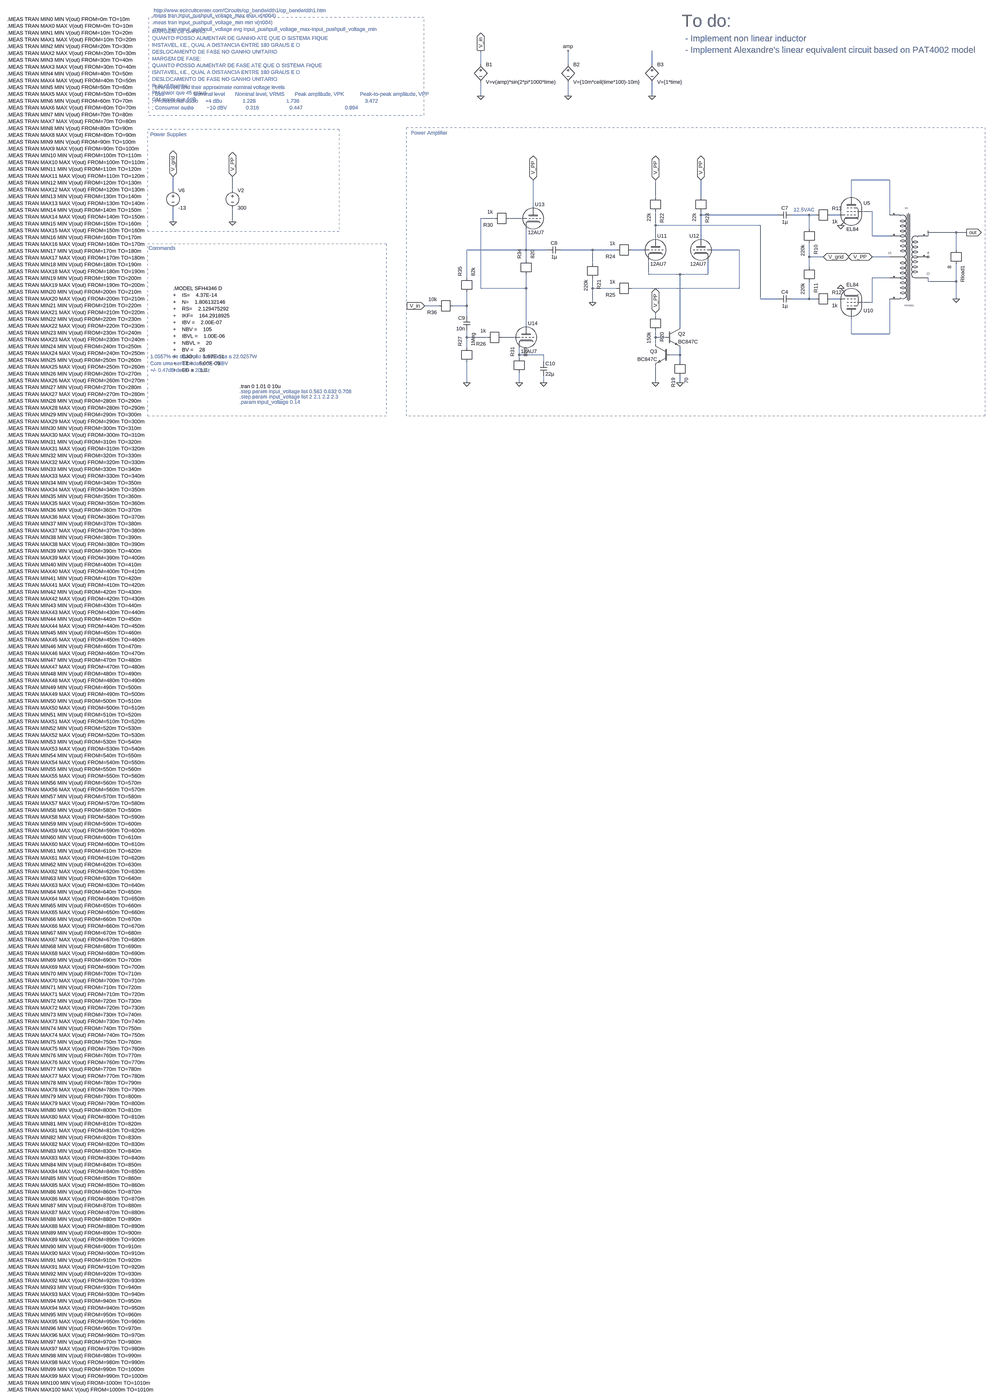
[diagram p0: schematic POWER_AMP_IC_rework_el84_transient_stairs.asc, whole sheet]
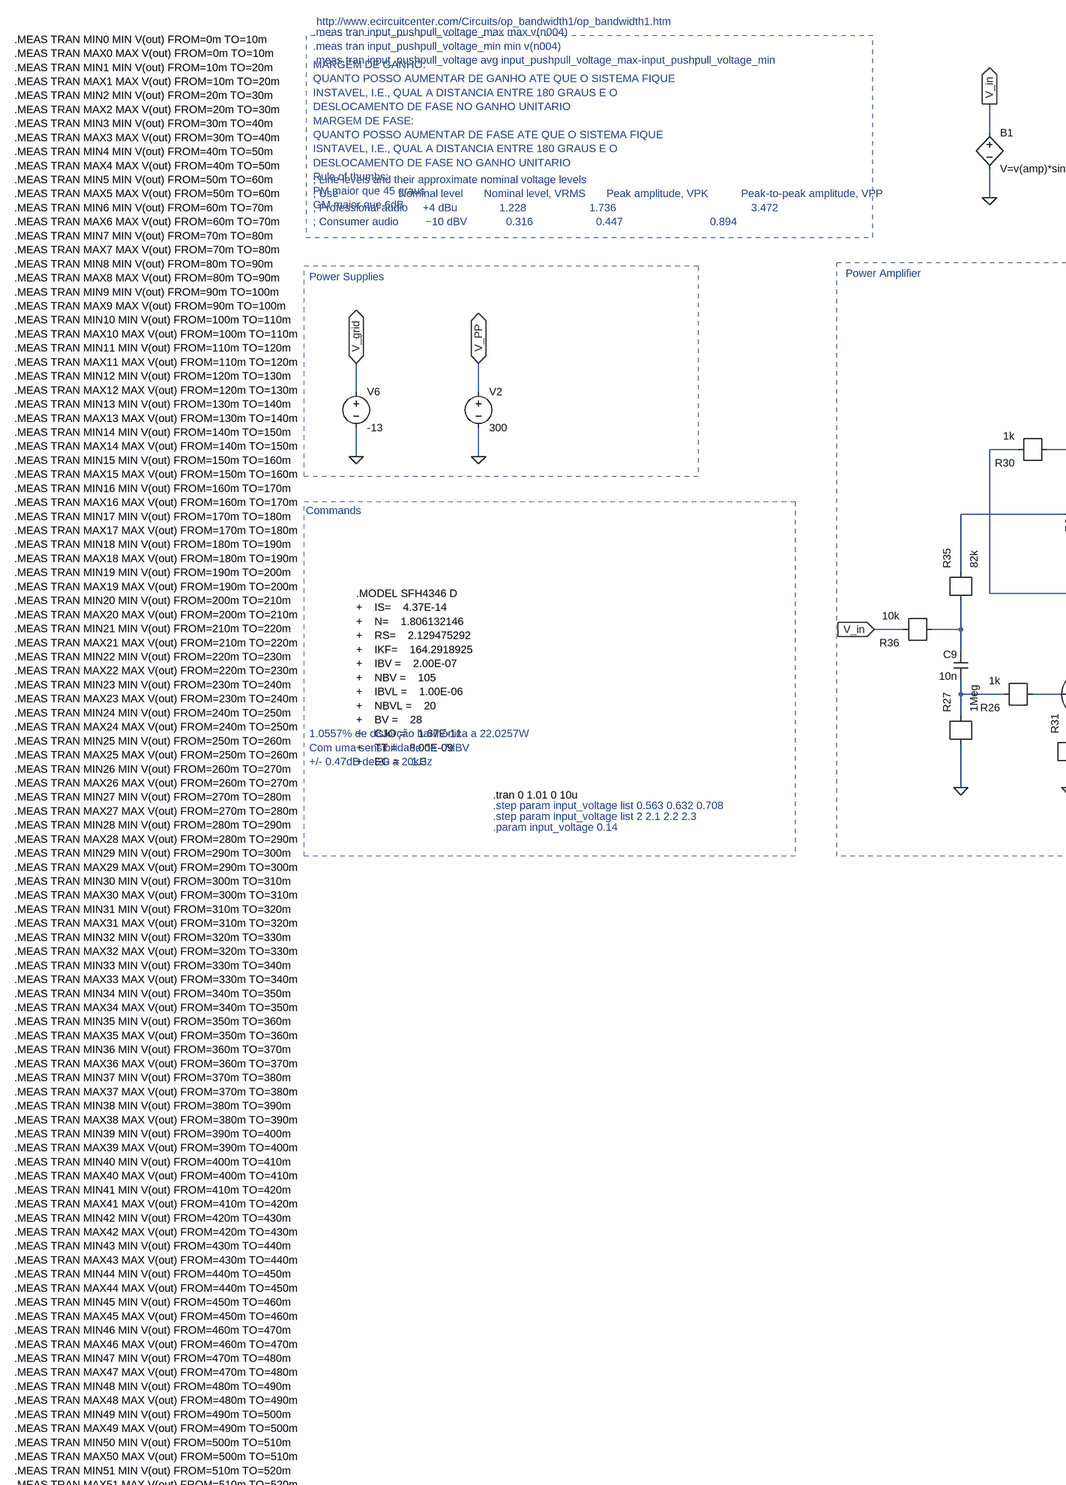
[diagram p1: schematic POWER_AMP_IC_rework_el84_transient_stairs.asc, part, row 1 of 2, column 1 of 2]
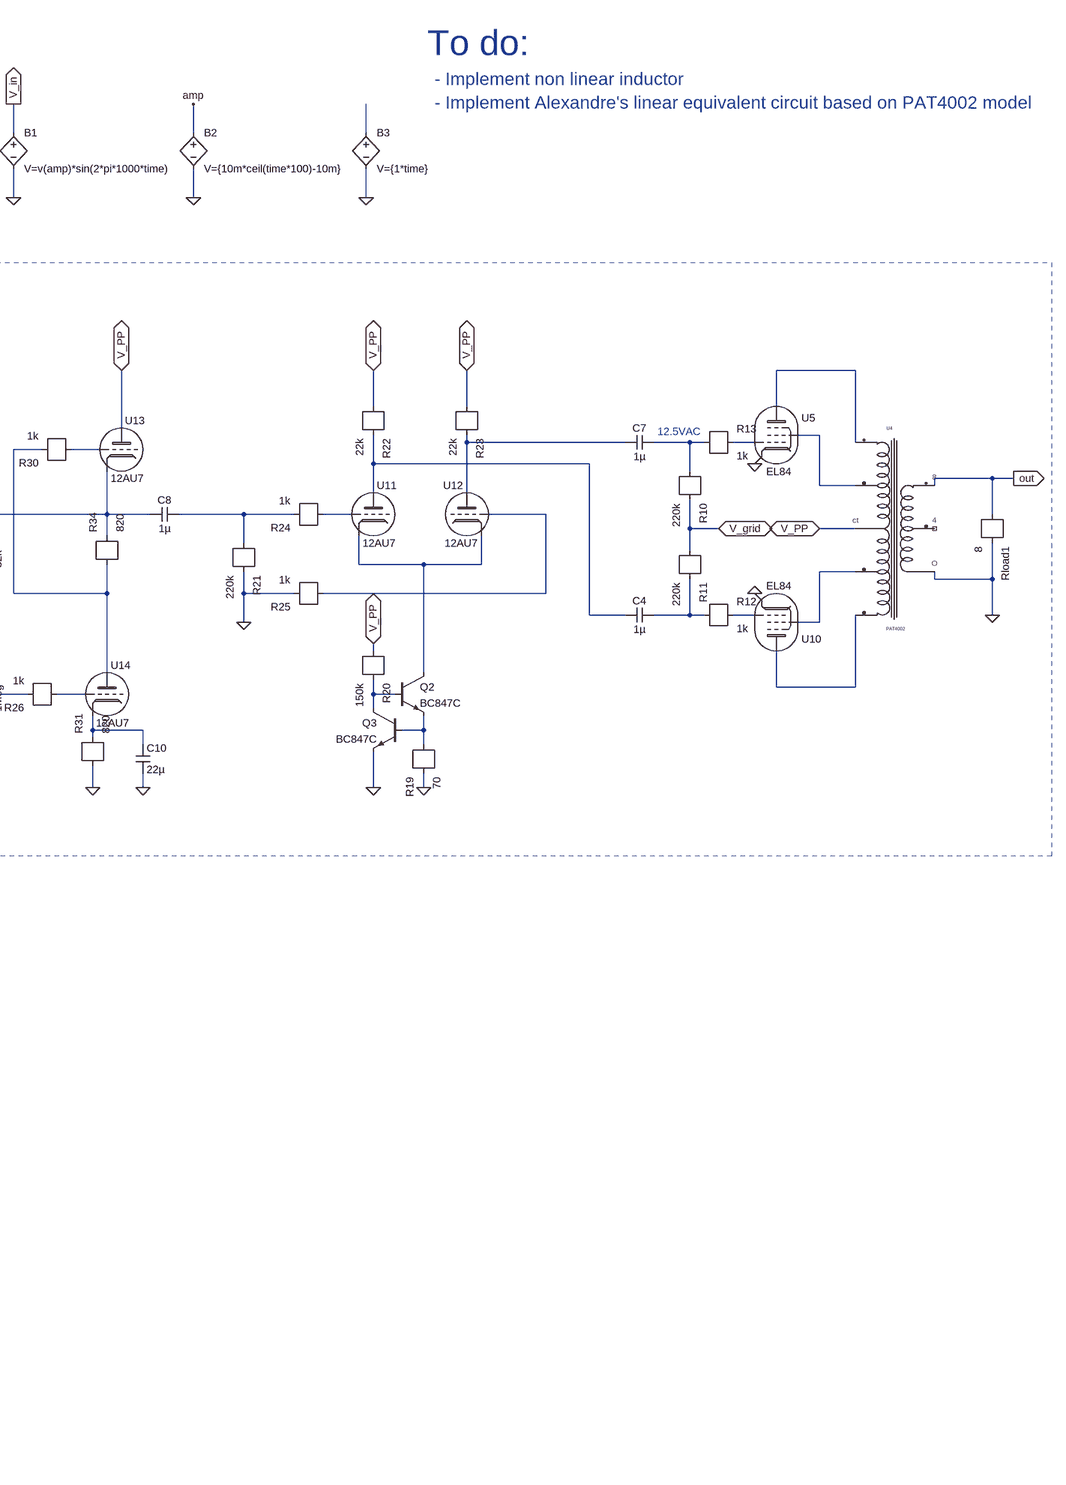
[diagram p2: schematic POWER_AMP_IC_rework_el84_transient_stairs.asc, part, row 1 of 2, column 2 of 2]
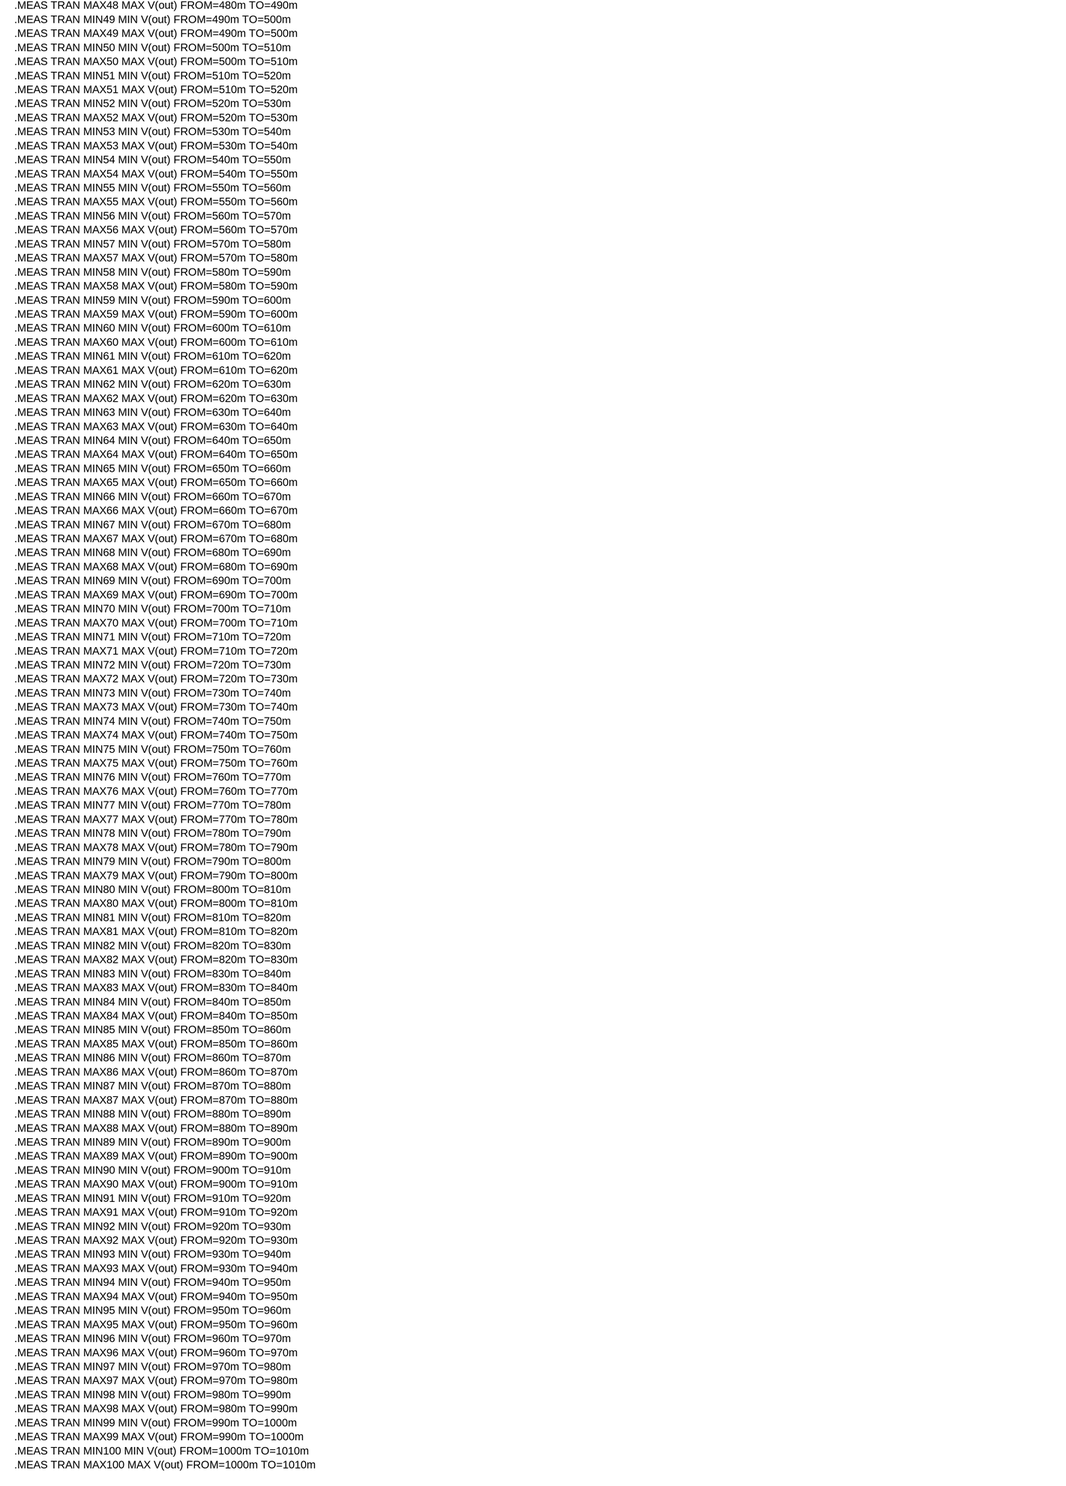
[diagram p3: schematic POWER_AMP_IC_rework_el84_transient_stairs.asc, part, row 2 of 2, column 1 of 2]
POWER_AMP_IC_rework_el84_transient_stairs.asc, the LTspice schematic file:
Version 4
SHEET 1 2188 56588
WIRE -1584 752 -1584 688
WIRE -1184 752 -1184 688
WIRE -800 752 -800 688
WIRE -1584 896 -1584 832
WIRE -1184 896 -1184 832
WIRE -800 896 -800 832
WIRE 288 1280 112 1280
WIRE -2992 1328 -2992 1264
WIRE -2720 1328 -2720 1264
WIRE -784 1360 -784 1280
WIRE -576 1360 -576 1280
WIRE 112 1360 112 1280
WIRE -1344 1408 -1344 1280
WIRE 208 1424 160 1424
WIRE -576 1440 -576 1424
WIRE -224 1440 -576 1440
WIRE -80 1440 -160 1440
WIRE -48 1440 -80 1440
WIRE 64 1440 16 1440
WIRE 288 1440 288 1280
WIRE -1520 1456 -1584 1456
WIRE -1392 1456 -1456 1456
WIRE -2992 1472 -2992 1408
WIRE -2720 1472 -2720 1408
WIRE -784 1488 -784 1424
WIRE -304 1488 -784 1488
WIRE -80 1504 -80 1440
WIRE 592 1520 464 1520
WIRE 640 1520 592 1520
WIRE 208 1536 208 1424
WIRE 288 1536 208 1536
WIRE 464 1536 464 1520
WIRE -784 1552 -784 1488
WIRE -576 1552 -576 1440
WIRE -1376 1600 -1376 1504
WIRE -1376 1600 -1648 1600
WIRE -1280 1600 -1376 1600
WIRE -1072 1600 -1216 1600
WIRE -960 1600 -1072 1600
WIRE -832 1600 -896 1600
WIRE -400 1600 -528 1600
WIRE 592 1600 592 1520
WIRE -80 1632 -80 1568
WIRE -16 1632 -80 1632
WIRE 288 1632 208 1632
WIRE -1376 1648 -1376 1600
WIRE -1072 1664 -1072 1600
WIRE -80 1680 -80 1632
WIRE -816 1712 -816 1648
WIRE -672 1712 -816 1712
WIRE -544 1712 -544 1648
WIRE -544 1712 -672 1712
WIRE -1648 1728 -1648 1600
WIRE 288 1728 208 1728
WIRE 464 1744 464 1728
WIRE 592 1744 592 1664
WIRE 592 1744 464 1744
WIRE -1584 1776 -1584 1456
WIRE -1376 1776 -1376 1712
WIRE -1376 1776 -1584 1776
WIRE -1072 1776 -1072 1728
WIRE -960 1776 -1072 1776
WIRE -400 1776 -400 1600
WIRE -400 1776 -896 1776
WIRE -304 1824 -304 1488
WIRE -224 1824 -304 1824
WIRE -80 1824 -80 1744
WIRE -80 1824 -160 1824
WIRE -48 1824 -80 1824
WIRE 64 1824 16 1824
WIRE 592 1824 592 1744
WIRE -1072 1840 -1072 1776
WIRE 208 1840 208 1728
WIRE 208 1840 160 1840
WIRE -1776 1856 -1840 1856
WIRE -1648 1856 -1648 1792
WIRE -1648 1856 -1712 1856
WIRE -1648 1904 -1648 1856
WIRE -784 1904 -784 1888
WIRE -1376 1952 -1376 1776
WIRE -672 1952 -672 1712
WIRE 112 1984 112 1904
WIRE 288 1984 288 1824
WIRE 288 1984 112 1984
WIRE -1648 2000 -1648 1968
WIRE -1552 2000 -1648 2000
WIRE -1424 2000 -1488 2000
WIRE -784 2000 -784 1968
WIRE -736 2000 -784 2000
WIRE -784 2032 -784 2000
WIRE -1648 2048 -1648 2000
WIRE -1408 2080 -1408 2048
WIRE -1296 2080 -1408 2080
WIRE -672 2080 -672 2048
WIRE -672 2080 -720 2080
WIRE -1408 2096 -1408 2080
WIRE -1296 2112 -1296 2080
WIRE -672 2112 -672 2080
WIRE -1648 2208 -1648 2112
WIRE -1408 2208 -1408 2160
WIRE -1296 2208 -1296 2176
WIRE -784 2208 -784 2128
WIRE -672 2208 -672 2176
FLAG -2720 1472 0
FLAG -2992 1472 0
FLAG -2992 1264 V_grid
IOPIN -2992 1264 BiDir
FLAG 64 1488 0
FLAG 64 1776 0
FLAG -16 1632 V_grid
IOPIN -16 1632 BiDir
FLAG 592 1824 0
FLAG 640 1520 out
IOPIN 640 1520 Out
FLAG -2720 1264 V_PP
IOPIN -2720 1264 BiDir
FLAG 208 1632 V_PP
IOPIN 208 1632 BiDir
FLAG -1072 1840 0
FLAG -1840 1856 V_in
IOPIN -1840 1856 In
FLAG -1648 2208 0
FLAG -1408 2208 0
FLAG -672 2208 0
FLAG -784 2208 0
FLAG -784 1888 V_PP
IOPIN -784 1888 BiDir
FLAG -576 1280 V_PP
IOPIN -576 1280 BiDir
FLAG -784 1280 V_PP
IOPIN -784 1280 BiDir
FLAG -1344 1280 V_PP
IOPIN -1344 1280 BiDir
FLAG -1296 2208 0
FLAG -1584 896 0
FLAG -1184 896 0
FLAG -1584 688 V_in
IOPIN -1584 688 Out
FLAG -800 896 0
FLAG -1184 688 amp
SYMBOL voltage -2720 1312 R0
SYMATTR InstName V2
SYMATTR Value 300
SYMBOL voltage -2992 1312 R0
SYMATTR InstName V6
SYMATTR Value -13
SYMBOL r -80 1504 R90
SYMATTR InstName R10
SYMATTR Value 220k
SYMBOL r -80 1680 R90
SYMATTR InstName R11
SYMATTR Value 220k
SYMBOL r -48 1824 R0
SYMATTR InstName R12
SYMATTR Value 1k
SYMBOL r -48 1440 R0
SYMATTR InstName R13
SYMATTR Value 1k
SYMBOL cap -160 1808 R90
WINDOW 0 0 32 VBottom 2
WINDOW 3 32 32 VTop 2
SYMATTR InstName C4
SYMATTR Value 1µ
SYMBOL cap -160 1424 R90
WINDOW 0 0 32 VBottom 2
WINDOW 3 32 32 VTop 2
SYMATTR InstName C7
SYMATTR Value 1µ
SYMBOL r 592 1600 R90
SYMATTR InstName Rload1
SYMATTR Value 8
SYMBOL PAT4002 368 1632 R0
SYMATTR InstName U4
SYMBOL EL84 112 1424 R0
SYMATTR InstName U5
SYMBOL EL84 112 1840 M180
SYMATTR InstName U10
SYMBOL npn -736 1952 R0
SYMATTR InstName Q2
SYMATTR Value BC847C
SYMBOL npn -720 2032 M0
SYMATTR InstName Q3
SYMATTR Value BC847C
SYMBOL r -672 2112 M90
SYMATTR InstName R19
SYMATTR Value 70
SYMBOL r -784 1904 R90
SYMATTR InstName R20
SYMATTR Value 150k
SYMBOL r -1072 1664 R90
SYMATTR InstName R21
SYMATTR Value 220k
SYMBOL r -784 1360 R90
SYMATTR InstName R22
SYMATTR Value 22k
SYMBOL r -576 1360 R90
SYMATTR InstName R23
SYMATTR Value 22k
SYMBOL 12AU7 -784 1600 R0
SYMATTR InstName U11
SYMBOL 12AU7 -576 1600 M0
SYMATTR InstName U12
SYMBOL cap -1216 1584 R90
WINDOW 0 0 32 VBottom 2
WINDOW 3 32 32 VTop 2
SYMATTR InstName C8
SYMATTR Value 1µ
SYMBOL r -896 1600 R180
SYMATTR InstName R24
SYMATTR Value 1k
SYMBOL r -896 1776 R180
SYMATTR InstName R25
SYMATTR Value 1k
SYMBOL r -1488 2000 R180
SYMATTR InstName R26
SYMATTR Value 1k
SYMBOL r -1648 2112 R270
SYMATTR InstName R27
SYMATTR Value 1Meg
SYMBOL r -1456 1456 R180
SYMATTR InstName R30
SYMATTR Value 1k
SYMBOL r -1408 2160 R270
SYMATTR InstName R31
SYMATTR Value 820
SYMBOL r -1376 1712 R270
SYMATTR InstName R34
SYMATTR Value 820
SYMBOL 12AU7 -1344 1456 R0
SYMATTR InstName U13
SYMBOL 12AU7 -1376 2000 R0
SYMATTR InstName U14
SYMBOL r -1648 1792 R270
SYMATTR InstName R35
SYMATTR Value 82k
SYMBOL cap -1632 1904 M0
SYMATTR InstName C9
SYMATTR Value 10n
SYMBOL r -1712 1856 R180
SYMATTR InstName R36
SYMATTR Value 10k
SYMBOL cap -1312 2112 R0
SYMATTR InstName C10
SYMATTR Value 22µ
SYMBOL bv -1584 736 R0
SYMATTR InstName B1
SYMATTR Value V=v(amp)*sin(2*pi*1000*time)
SYMBOL bv -1184 736 R0
SYMATTR InstName B2
SYMATTR Value V={10m*ceil(time*100)-10m}
SYMBOL bv -800 736 R0
SYMATTR InstName B3
SYMATTR Value V={1*time}
TEXT -2688 2224 Left 2 !.tran 0 1.01 0 10u
TEXT -2992 1776 Left 2 !.MODEL SFH4346 D	\n+	IS=	4.37E-14\n+	N=	1.806132146\n+	RS=	2.129475292\n+	IKF=	164.2918925\n+	IBV =	2.00E-07\n+	NBV =	105\n+	IBVL =	1.00E-06\n+	NBVL =	20\n+	BV =	28\n+	CJO =	1.67E-11\n+	TT =	8.00E-09\n+	EG =	1.3
TEXT -3104 1592 Left 2 ;Commands
TEXT -3096 1072 Left 2 ;Power Supplies
TEXT -3088 600 Left 2 ;MARGEM DE GANHO:\nQUANTO POSSO AUMENTAR DE GANHO ATE QUE O SISTEMA FIQUE\nINSTAVEL, I.E., QUAL A DISTANCIA ENTRE 180 GRAUS E O \nDESLOCAMENTO DE FASE NO GANHO UNITARIO\nMARGEM DE FASE:\nQUANTO POSSO AUMENTAR DE FASE ATE QUE O SISTEMA FIQUE \nISNTAVEL, I.E., QUAL A DISTANCIA ENTRE 180 GRAUS E O \nDESLOCAMENTO DE FASE NO GANHO UNITARIO\nRule of thumbs:\nPM maior que 45 graus\nGM maior que 6dB
TEXT -1904 1064 Left 2 ;Power Amplifier
TEXT -2688 2248 Left 2 ;.step param input_voltage list 0.563 0.632 0.708
TEXT -3096 2088 Left 2 ;1.0557% de distorção harmônica a 22.0257W\nCom uma sensibilidade de -7dBV\n+/- 0.47dB de 20 a 20kHz
TEXT -2688 2272 Left 2 ;.step param input_voltage list 2 2.1 2.2 2.3
TEXT -2688 2296 Left 2 ;.param input_voltage 0.14
TEXT -3088 856 Left 2 ;; Line levels and their approximate nominal voltage levels\n; Use                	Nominal level   	Nominal level, VRMS   	Peak amplitude, VPK   		Peak-to-peak amplitude, VPP\n; Professional audio 	+4 dBu          	1.228                 	1.736                 							3.472\n; Consumer audio     	−10 dBV         	0.316                 	0.447                 			0.894
TEXT -3088 528 Left 2 ;.meas tran input_pushpull_voltage_max max v(n004)\n.meas tran input_pushpull_voltage_min min v(n004)\n.meas tran input_pushpull_voltage avg input_pushpull_voltage_max-input_pushpull_voltage_min
TEXT -152 1416 Left 2 ;12.5VAC
TEXT -3080 504 Left 2 ;http://www.ecircuitcenter.com/Circuits/op_bandwidth1/op_bandwidth1.htm
TEXT -664 552 Left 6 ;To do:
TEXT -648 632 Left 4 ;- Implement non linear inductor\n- Implement Alexandre's linear equivalent circuit based on PAT4002 model
TEXT -3752 544 Left 2 !.MEAS TRAN MIN0 MIN V(out) FROM=0m TO=10m\n.MEAS TRAN MAX0 MAX V(out) FROM=0m TO=10m\n.MEAS TRAN MIN1 MIN V(out) FROM=10m TO=20m\n.MEAS TRAN MAX1 MAX V(out) FROM=10m TO=20m\n.MEAS TRAN MIN2 MIN V(out) FROM=20m TO=30m\n.MEAS TRAN MAX2 MAX V(out) FROM=20m TO=30m\n.MEAS TRAN MIN3 MIN V(out) FROM=30m TO=40m\n.MEAS TRAN MAX3 MAX V(out) FROM=30m TO=40m\n.MEAS TRAN MIN4 MIN V(out) FROM=40m TO=50m\n.MEAS TRAN MAX4 MAX V(out) FROM=40m TO=50m\n.MEAS TRAN MIN5 MIN V(out) FROM=50m TO=60m\n.MEAS TRAN MAX5 MAX V(out) FROM=50m TO=60m\n.MEAS TRAN MIN6 MIN V(out) FROM=60m TO=70m\n.MEAS TRAN MAX6 MAX V(out) FROM=60m TO=70m\n.MEAS TRAN MIN7 MIN V(out) FROM=70m TO=80m\n.MEAS TRAN MAX7 MAX V(out) FROM=70m TO=80m\n.MEAS TRAN MIN8 MIN V(out) FROM=80m TO=90m\n.MEAS TRAN MAX8 MAX V(out) FROM=80m TO=90m\n.MEAS TRAN MIN9 MIN V(out) FROM=90m TO=100m\n.MEAS TRAN MAX9 MAX V(out) FROM=90m TO=100m\n.MEAS TRAN MIN10 MIN V(out) FROM=100m TO=110m\n.MEAS TRAN MAX10 MAX V(out) FROM=100m TO=110m\n.MEAS TRAN MIN11 MIN V(out) FROM=110m TO=120m\n.MEAS TRAN MAX11 MAX V(out) FROM=110m TO=120m\n.MEAS TRAN MIN12 MIN V(out) FROM=120m TO=130m\n.MEAS TRAN MAX12 MAX V(out) FROM=120m TO=130m\n.MEAS TRAN MIN13 MIN V(out) FROM=130m TO=140m\n.MEAS TRAN MAX13 MAX V(out) FROM=130m TO=140m\n.MEAS TRAN MIN14 MIN V(out) FROM=140m TO=150m\n.MEAS TRAN MAX14 MAX V(out) FROM=140m TO=150m\n.MEAS TRAN MIN15 MIN V(out) FROM=150m TO=160m\n.MEAS TRAN MAX15 MAX V(out) FROM=150m TO=160m\n.MEAS TRAN MIN16 MIN V(out) FROM=160m TO=170m\n.MEAS TRAN MAX16 MAX V(out) FROM=160m TO=170m\n.MEAS TRAN MIN17 MIN V(out) FROM=170m TO=180m\n.MEAS TRAN MAX17 MAX V(out) FROM=170m TO=180m\n.MEAS TRAN MIN18 MIN V(out) FROM=180m TO=190m\n.MEAS TRAN MAX18 MAX V(out) FROM=180m TO=190m\n.MEAS TRAN MIN19 MIN V(out) FROM=190m TO=200m\n.MEAS TRAN MAX19 MAX V(out) FROM=190m TO=200m\n.MEAS TRAN MIN20 MIN V(out) FROM=200m TO=210m\n.MEAS TRAN MAX20 MAX V(out) FROM=200m TO=210m\n.MEAS TRAN MIN21 MIN V(out) FROM=210m TO=220m\n.MEAS TRAN MAX21 MAX V(out) FROM=210m TO=220m\n.MEAS TRAN MIN22 MIN V(out) FROM=220m TO=230m\n.MEAS TRAN MAX22 MAX V(out) FROM=220m TO=230m\n.MEAS TRAN MIN23 MIN V(out) FROM=230m TO=240m\n.MEAS TRAN MAX23 MAX V(out) FROM=230m TO=240m\n.MEAS TRAN MIN24 MIN V(out) FROM=240m TO=250m\n.MEAS TRAN MAX24 MAX V(out) FROM=240m TO=250m\n.MEAS TRAN MIN25 MIN V(out) FROM=250m TO=260m\n.MEAS TRAN MAX25 MAX V(out) FROM=250m TO=260m\n.MEAS TRAN MIN26 MIN V(out) FROM=260m TO=270m\n.MEAS TRAN MAX26 MAX V(out) FROM=260m TO=270m\n.MEAS TRAN MIN27 MIN V(out) FROM=270m TO=280m\n.MEAS TRAN MAX27 MAX V(out) FROM=270m TO=280m\n.MEAS TRAN MIN28 MIN V(out) FROM=280m TO=290m\n.MEAS TRAN MAX28 MAX V(out) FROM=280m TO=290m\n.MEAS TRAN MIN29 MIN V(out) FROM=290m TO=300m\n.MEAS TRAN MAX29 MAX V(out) FROM=290m TO=300m\n.MEAS TRAN MIN30 MIN V(out) FROM=300m TO=310m\n.MEAS TRAN MAX30 MAX V(out) FROM=300m TO=310m\n.MEAS TRAN MIN31 MIN V(out) FROM=310m TO=320m\n.MEAS TRAN MAX31 MAX V(out) FROM=310m TO=320m\n.MEAS TRAN MIN32 MIN V(out) FROM=320m TO=330m\n.MEAS TRAN MAX32 MAX V(out) FROM=320m TO=330m\n.MEAS TRAN MIN33 MIN V(out) FROM=330m TO=340m\n.MEAS TRAN MAX33 MAX V(out) FROM=330m TO=340m\n.MEAS TRAN MIN34 MIN V(out) FROM=340m TO=350m\n.MEAS TRAN MAX34 MAX V(out) FROM=340m TO=350m\n.MEAS TRAN MIN35 MIN V(out) FROM=350m TO=360m\n.MEAS TRAN MAX35 MAX V(out) FROM=350m TO=360m\n.MEAS TRAN MIN36 MIN V(out) FROM=360m TO=370m\n.MEAS TRAN MAX36 MAX V(out) FROM=360m TO=370m\n.MEAS TRAN MIN37 MIN V(out) FROM=370m TO=380m\n.MEAS TRAN MAX37 MAX V(out) FROM=370m TO=380m\n.MEAS TRAN MIN38 MIN V(out) FROM=380m TO=390m\n.MEAS TRAN MAX38 MAX V(out) FROM=380m TO=390m\n.MEAS TRAN MIN39 MIN V(out) FROM=390m TO=400m\n.MEAS TRAN MAX39 MAX V(out) FROM=390m TO=400m\n.MEAS TRAN MIN40 MIN V(out) FROM=400m TO=410m\n.MEAS TRAN MAX40 MAX V(out) FROM=400m TO=410m\n.MEAS TRAN MIN41 MIN V(out) FROM=410m TO=420m\n.MEAS TRAN MAX41 MAX V(out) FROM=410m TO=420m\n.MEAS TRAN MIN42 MIN V(out) FROM=420m TO=430m\n.MEAS TRAN MAX42 MAX V(out) FROM=420m TO=430m\n.MEAS TRAN MIN43 MIN V(out) FROM=430m TO=440m\n.MEAS TRAN MAX43 MAX V(out) FROM=430m TO=440m\n.MEAS TRAN MIN44 MIN V(out) FROM=440m TO=450m\n.MEAS TRAN MAX44 MAX V(out) FROM=440m TO=450m\n.MEAS TRAN MIN45 MIN V(out) FROM=450m TO=460m\n.MEAS TRAN MAX45 MAX V(out) FROM=450m TO=460m\n.MEAS TRAN MIN46 MIN V(out) FROM=460m TO=470m\n.MEAS TRAN MAX46 MAX V(out) FROM=460m TO=470m\n.MEAS TRAN MIN47 MIN V(out) FROM=470m TO=480m\n.MEAS TRAN MAX47 MAX V(out) FROM=470m TO=480m\n.MEAS TRAN MIN48 MIN V(out) FROM=480m TO=490m\n.MEAS TRAN MAX48 MAX V(out) FROM=480m TO=490m\n.MEAS TRAN MIN49 MIN V(out) FROM=490m TO=500m\n.MEAS TRAN MAX49 MAX V(out) FROM=490m TO=500m\n.MEAS TRAN MIN50 MIN V(out) FROM=500m TO=510m\n.MEAS TRAN MAX50 MAX V(out) FROM=500m TO=510m\n.MEAS TRAN MIN51 MIN V(out) FROM=510m TO=520m\n.MEAS TRAN MAX51 MAX V(out) FROM=510m TO=520m\n.MEAS TRAN MIN52 MIN V(out) FROM=520m TO=530m\n.MEAS TRAN MAX52 MAX V(out) FROM=520m TO=530m\n.MEAS TRAN MIN53 MIN V(out) FROM=530m TO=540m\n.MEAS TRAN MAX53 MAX V(out) FROM=530m TO=540m\n.MEAS TRAN MIN54 MIN V(out) FROM=540m TO=550m\n.MEAS TRAN MAX54 MAX V(out) FROM=540m TO=550m\n.MEAS TRAN MIN55 MIN V(out) FROM=550m TO=560m\n.MEAS TRAN MAX55 MAX V(out) FROM=550m TO=560m\n.MEAS TRAN MIN56 MIN V(out) FROM=560m TO=570m\n.MEAS TRAN MAX56 MAX V(out) FROM=560m TO=570m\n.MEAS TRAN MIN57 MIN V(out) FROM=570m TO=580m\n.MEAS TRAN MAX57 MAX V(out) FROM=570m TO=580m\n.MEAS TRAN MIN58 MIN V(out) FROM=580m TO=590m\n.MEAS TRAN MAX58 MAX V(out) FROM=580m TO=590m\n.MEAS TRAN MIN59 MIN V(out) FROM=590m TO=600m\n.MEAS TRAN MAX59 MAX V(out) FROM=590m TO=600m\n.MEAS TRAN MIN60 MIN V(out) FROM=600m TO=610m\n.MEAS TRAN MAX60 MAX V(out) FROM=600m TO=610m\n.MEAS TRAN MIN61 MIN V(out) FROM=610m TO=620m\n.MEAS TRAN MAX61 MAX V(out) FROM=610m TO=620m\n.MEAS TRAN MIN62 MIN V(out) FROM=620m TO=630m\n.MEAS TRAN MAX62 MAX V(out) FROM=620m TO=630m\n.MEAS TRAN MIN63 MIN V(out) FROM=630m TO=640m\n.MEAS TRAN MAX63 MAX V(out) FROM=630m TO=640m\n.MEAS TRAN MIN64 MIN V(out) FROM=640m TO=650m\n.MEAS TRAN MAX64 MAX V(out) FROM=640m TO=650m\n.MEAS TRAN MIN65 MIN V(out) FROM=650m TO=660m\n.MEAS TRAN MAX65 MAX V(out) FROM=650m TO=660m\n.MEAS TRAN MIN66 MIN V(out) FROM=660m TO=670m\n.MEAS TRAN MAX66 MAX V(out) FROM=660m TO=670m\n.MEAS TRAN MIN67 MIN V(out) FROM=670m TO=680m\n.MEAS TRAN MAX67 MAX V(out) FROM=670m TO=680m\n.MEAS TRAN MIN68 MIN V(out) FROM=680m TO=690m\n.MEAS TRAN MAX68 MAX V(out) FROM=680m TO=690m\n.MEAS TRAN MIN69 MIN V(out) FROM=690m TO=700m\n.MEAS TRAN MAX69 MAX V(out) FROM=690m TO=700m\n.MEAS TRAN MIN70 MIN V(out) FROM=700m TO=710m\n.MEAS TRAN MAX70 MAX V(out) FROM=700m TO=710m\n.MEAS TRAN MIN71 MIN V(out) FROM=710m TO=720m\n.MEAS TRAN MAX71 MAX V(out) FROM=710m TO=720m\n.MEAS TRAN MIN72 MIN V(out) FROM=720m TO=730m\n.MEAS TRAN MAX72 MAX V(out) FROM=720m TO=730m\n.MEAS TRAN MIN73 MIN V(out) FROM=730m TO=740m\n.MEAS TRAN MAX73 MAX V(out) FROM=730m TO=740m\n.MEAS TRAN MIN74 MIN V(out) FROM=740m TO=750m\n.MEAS TRAN MAX74 MAX V(out) FROM=740m TO=750m\n.MEAS TRAN MIN75 MIN V(out) FROM=750m TO=760m\n.MEAS TRAN MAX75 MAX V(out) FROM=750m TO=760m\n.MEAS TRAN MIN76 MIN V(out) FROM=760m TO=770m\n.MEAS TRAN MAX76 MAX V(out) FROM=760m TO=770m\n.MEAS TRAN MIN77 MIN V(out) FROM=770m TO=780m\n.MEAS TRAN MAX77 MAX V(out) FROM=770m TO=780m\n.MEAS TRAN MIN78 MIN V(out) FROM=780m TO=790m\n.MEAS TRAN MAX78 MAX V(out) FROM=780m TO=790m\n.MEAS TRAN MIN79 MIN V(out) FROM=790m TO=800m\n.MEAS TRAN MAX79 MAX V(out) FROM=790m TO=800m\n.MEAS TRAN MIN80 MIN V(out) FROM=800m TO=810m\n.MEAS TRAN MAX80 MAX V(out) FROM=800m TO=810m\n.MEAS TRAN MIN81 MIN V(out) FROM=810m TO=820m\n.MEAS TRAN MAX81 MAX V(out) FROM=810m TO=820m\n.MEAS TRAN MIN82 MIN V(out) FROM=820m TO=830m\n.MEAS TRAN MAX82 MAX V(out) FROM=820m TO=830m\n.MEAS TRAN MIN83 MIN V(out) FROM=830m TO=840m\n.MEAS TRAN MAX83 MAX V(out) FROM=830m TO=840m\n.MEAS TRAN MIN84 MIN V(out) FROM=840m TO=850m\n.MEAS TRAN MAX84 MAX V(out) FROM=840m TO=850m\n.MEAS TRAN MIN85 MIN V(out) FROM=850m TO=860m\n.MEAS TRAN MAX85 MAX V(out) FROM=850m TO=860m\n.MEAS TRAN MIN86 MIN V(out) FROM=860m TO=870m\n.MEAS TRAN MAX86 MAX V(out) FROM=860m TO=870m\n.MEAS TRAN MIN87 MIN V(out) FROM=870m TO=880m\n.MEAS TRAN MAX87 MAX V(out) FROM=870m TO=880m\n.MEAS TRAN MIN88 MIN V(out) FROM=880m TO=890m\n.MEAS TRAN MAX88 MAX V(out) FROM=880m TO=890m\n.MEAS TRAN MIN89 MIN V(out) FROM=890m TO=900m\n.MEAS TRAN MAX89 MAX V(out) FROM=890m TO=900m\n.MEAS TRAN MIN90 MIN V(out) FROM=900m TO=910m\n.MEAS TRAN MAX90 MAX V(out) FROM=900m TO=910m\n.MEAS TRAN MIN91 MIN V(out) FROM=910m TO=920m\n.MEAS TRAN MAX91 MAX V(out) FROM=910m TO=920m\n.MEAS TRAN MIN92 MIN V(out) FROM=920m TO=930m\n.MEAS TRAN MAX92 MAX V(out) FROM=920m TO=930m\n.MEAS TRAN MIN93 MIN V(out) FROM=930m TO=940m\n.MEAS TRAN MAX93 MAX V(out) FROM=930m TO=940m\n.MEAS TRAN MIN94 MIN V(out) FROM=940m TO=950m\n.MEAS TRAN MAX94 MAX V(out) FROM=940m TO=950m\n.MEAS TRAN MIN95 MIN V(out) FROM=950m TO=960m\n.MEAS TRAN MAX95 MAX V(out) FROM=950m TO=960m\n.MEAS TRAN MIN96 MIN V(out) FROM=960m TO=970m\n.MEAS TRAN MAX96 MAX V(out) FROM=960m TO=970m\n.MEAS TRAN MIN97 MIN V(out) FROM=970m TO=980m\n.MEAS TRAN MAX97 MAX V(out) FROM=970m TO=980m\n.MEAS TRAN MIN98 MIN V(out) FROM=980m TO=990m\n.MEAS TRAN MAX98 MAX V(out) FROM=980m TO=990m\n.MEAS TRAN MIN99 MIN V(out) FROM=990m TO=1000m\n.MEAS TRAN MAX99 MAX V(out) FROM=990m TO=1000m\n.MEAS TRAN MIN100 MIN V(out) FROM=1000m TO=1010m\n.MEAS TRAN MAX100 MAX V(out) FROM=1000m TO=1010m
RECTANGLE Normal -3108 1572 -2016 2360 2
RECTANGLE Normal -3108 1048 -2232 1516 2
RECTANGLE Normal -1924 1040 724 2360 2
RECTANGLE Normal -3104 984 -1844 536 2

The netlist it stands for:
* POWER_AMP_IC_rework_el84_transient_stairs.asc
V2 V_PP 0 300
V6 V_grid 0 -13
R10 V_grid N005 220k
R11 N016 V_grid 220k
R12 N017 N016 1k
R13 N006 N005 1k
C4 N016 N009 1µ
C7 N005 N004 1µ
Rload1 0 out 8
XU4 N002 N003 V_PP N015 N019 out NC_01 0 PAT4002  ; pins p1 st1 ct st2 p2 8 4 O
XU5 N002 N003 N006 0 EL84  ; pins Placa Grade_Screen Grade_controle Câtodo
XU10 N019 N015 N017 0 EL84  ; pins Placa Grade_Screen Grade_controle Câtodo
Q2 N014 N022 N024 0 BC847C
Q3 N022 N024 0 0 BC847C
R19 0 N024 70
R20 N022 V_PP 150k
R21 0 N011 220k
R22 N009 V_PP 22k
R23 N004 V_PP 22k
XU11 N009 N012 N014 12AU7  ; pins Plate Grid Cathode
XU12 N004 N013 N014 12AU7  ; pins Plate Grid Cathode
C8 N011 N010 1µ
R24 N011 N012 1k
R25 0 N013 1k
R26 N020 N021 1k
R27 N020 0 1Meg
R30 N007 N008 1k
R31 N023 0 820
R34 N010 N007 820
XU13 V_PP N008 N010 12AU7  ; pins Plate Grid Cathode
XU14 N007 N021 N023 12AU7  ; pins Plate Grid Cathode
R35 N010 N018 82k
C9 N018 N020 10n
R36 V_in N018 10k
C10 N023 0 22µ
B1 V_in 0 V=v(amp)*sin(2*pi*1000*time)
B2 amp 0 V={10m*ceil(time*100)-10m}
B3 N001 0 V={1*time}
.model NPN NPN
.model PNP PNP
.lib standard.bjt
.tran 0 1.01 0 10u
.MODEL SFH4346 D
+	IS=	4.37E-14
+	N=	1.806132146
+	RS=	2.129475292
+	IKF=	164.2918925
+	IBV =	2.00E-07
+	NBV =	105
+	IBVL =	1.00E-06
+	NBVL =	20
+	BV =	28
+	CJO =	1.67E-11
+	TT =	8.00E-09
+	EG =	1.3
* Commands
* Power Supplies
* MARGEM DE GANHO:
* QUANTO POSSO AUMENTAR DE GANHO ATE QUE O SISTEMA FIQUE
* INSTAVEL, I.E., QUAL A DISTANCIA ENTRE 180 GRAUS E O
* DESLOCAMENTO DE FASE NO GANHO UNITARIO
* MARGEM DE FASE:
* QUANTO POSSO AUMENTAR DE FASE ATE QUE O SISTEMA FIQUE
* ISNTAVEL, I.E., QUAL A DISTANCIA ENTRE 180 GRAUS E O
* DESLOCAMENTO DE FASE NO GANHO UNITARIO
* Rule of thumbs:
* PM maior que 45 graus
* GM maior que 6dB
* Power Amplifier
* .step param input_voltage list 0.563 0.632 0.708
* 1.0557% de distorção harmônica a 22.0257W
* Com uma sensibilidade de -7dBV
* +/- 0.47dB de 20 a 20kHz
* .step param input_voltage list 2 2.1 2.2 2.3
* .param input_voltage 0.14
* ; Line levels and their approximate nominal voltage levels
* ; Use                	Nominal level   	Nominal level, VRMS   	Peak amplitude, VPK   		Peak-to-peak amplitude, VPP
* ; Professional audio 	+4 dBu          	1.228                 	1.736                 							3.472
* ; Consumer audio     	−10 dBV         	0.316                 	0.447                 			0.894
* .meas tran input_pushpull_voltage_max max v(n004)
* .meas tran input_pushpull_voltage_min min v(n004)
* .meas tran input_pushpull_voltage avg input_pushpull_voltage_max-input_pushpull_voltage_min
* 12.5VAC
* http://www.ecircuitcenter.com/Circuits/op_bandwidth1/op_bandwidth1.htm
* To do:
* - Implement non linear inductor
* - Implement Alexandre's linear equivalent circuit based on PAT4002 model
.MEAS TRAN MIN0 MIN V(out) FROM=0m TO=10m
.MEAS TRAN MAX0 MAX V(out) FROM=0m TO=10m
.MEAS TRAN MIN1 MIN V(out) FROM=10m TO=20m
.MEAS TRAN MAX1 MAX V(out) FROM=10m TO=20m
.MEAS TRAN MIN2 MIN V(out) FROM=20m TO=30m
.MEAS TRAN MAX2 MAX V(out) FROM=20m TO=30m
.MEAS TRAN MIN3 MIN V(out) FROM=30m TO=40m
.MEAS TRAN MAX3 MAX V(out) FROM=30m TO=40m
.MEAS TRAN MIN4 MIN V(out) FROM=40m TO=50m
.MEAS TRAN MAX4 MAX V(out) FROM=40m TO=50m
.MEAS TRAN MIN5 MIN V(out) FROM=50m TO=60m
.MEAS TRAN MAX5 MAX V(out) FROM=50m TO=60m
.MEAS TRAN MIN6 MIN V(out) FROM=60m TO=70m
.MEAS TRAN MAX6 MAX V(out) FROM=60m TO=70m
.MEAS TRAN MIN7 MIN V(out) FROM=70m TO=80m
.MEAS TRAN MAX7 MAX V(out) FROM=70m TO=80m
.MEAS TRAN MIN8 MIN V(out) FROM=80m TO=90m
.MEAS TRAN MAX8 MAX V(out) FROM=80m TO=90m
.MEAS TRAN MIN9 MIN V(out) FROM=90m TO=100m
.MEAS TRAN MAX9 MAX V(out) FROM=90m TO=100m
.MEAS TRAN MIN10 MIN V(out) FROM=100m TO=110m
.MEAS TRAN MAX10 MAX V(out) FROM=100m TO=110m
.MEAS TRAN MIN11 MIN V(out) FROM=110m TO=120m
.MEAS TRAN MAX11 MAX V(out) FROM=110m TO=120m
.MEAS TRAN MIN12 MIN V(out) FROM=120m TO=130m
.MEAS TRAN MAX12 MAX V(out) FROM=120m TO=130m
.MEAS TRAN MIN13 MIN V(out) FROM=130m TO=140m
.MEAS TRAN MAX13 MAX V(out) FROM=130m TO=140m
.MEAS TRAN MIN14 MIN V(out) FROM=140m TO=150m
.MEAS TRAN MAX14 MAX V(out) FROM=140m TO=150m
.MEAS TRAN MIN15 MIN V(out) FROM=150m TO=160m
.MEAS TRAN MAX15 MAX V(out) FROM=150m TO=160m
.MEAS TRAN MIN16 MIN V(out) FROM=160m TO=170m
.MEAS TRAN MAX16 MAX V(out) FROM=160m TO=170m
.MEAS TRAN MIN17 MIN V(out) FROM=170m TO=180m
.MEAS TRAN MAX17 MAX V(out) FROM=170m TO=180m
.MEAS TRAN MIN18 MIN V(out) FROM=180m TO=190m
.MEAS TRAN MAX18 MAX V(out) FROM=180m TO=190m
.MEAS TRAN MIN19 MIN V(out) FROM=190m TO=200m
.MEAS TRAN MAX19 MAX V(out) FROM=190m TO=200m
.MEAS TRAN MIN20 MIN V(out) FROM=200m TO=210m
.MEAS TRAN MAX20 MAX V(out) FROM=200m TO=210m
.MEAS TRAN MIN21 MIN V(out) FROM=210m TO=220m
.MEAS TRAN MAX21 MAX V(out) FROM=210m TO=220m
.MEAS TRAN MIN22 MIN V(out) FROM=220m TO=230m
.MEAS TRAN MAX22 MAX V(out) FROM=220m TO=230m
.MEAS TRAN MIN23 MIN V(out) FROM=230m TO=240m
.MEAS TRAN MAX23 MAX V(out) FROM=230m TO=240m
.MEAS TRAN MIN24 MIN V(out) FROM=240m TO=250m
.MEAS TRAN MAX24 MAX V(out) FROM=240m TO=250m
.MEAS TRAN MIN25 MIN V(out) FROM=250m TO=260m
.MEAS TRAN MAX25 MAX V(out) FROM=250m TO=260m
.MEAS TRAN MIN26 MIN V(out) FROM=260m TO=270m
.MEAS TRAN MAX26 MAX V(out) FROM=260m TO=270m
.MEAS TRAN MIN27 MIN V(out) FROM=270m TO=280m
.MEAS TRAN MAX27 MAX V(out) FROM=270m TO=280m
.MEAS TRAN MIN28 MIN V(out) FROM=280m TO=290m
.MEAS TRAN MAX28 MAX V(out) FROM=280m TO=290m
.MEAS TRAN MIN29 MIN V(out) FROM=290m TO=300m
.MEAS TRAN MAX29 MAX V(out) FROM=290m TO=300m
.MEAS TRAN MIN30 MIN V(out) FROM=300m TO=310m
.MEAS TRAN MAX30 MAX V(out) FROM=300m TO=310m
.MEAS TRAN MIN31 MIN V(out) FROM=310m TO=320m
.MEAS TRAN MAX31 MAX V(out) FROM=310m TO=320m
.MEAS TRAN MIN32 MIN V(out) FROM=320m TO=330m
.MEAS TRAN MAX32 MAX V(out) FROM=320m TO=330m
.MEAS TRAN MIN33 MIN V(out) FROM=330m TO=340m
.MEAS TRAN MAX33 MAX V(out) FROM=330m TO=340m
.MEAS TRAN MIN34 MIN V(out) FROM=340m TO=350m
.MEAS TRAN MAX34 MAX V(out) FROM=340m TO=350m
.MEAS TRAN MIN35 MIN V(out) FROM=350m TO=360m
.MEAS TRAN MAX35 MAX V(out) FROM=350m TO=360m
.MEAS TRAN MIN36 MIN V(out) FROM=360m TO=370m
.MEAS TRAN MAX36 MAX V(out) FROM=360m TO=370m
.MEAS TRAN MIN37 MIN V(out) FROM=370m TO=380m
.MEAS TRAN MAX37 MAX V(out) FROM=370m TO=380m
.MEAS TRAN MIN38 MIN V(out) FROM=380m TO=390m
.MEAS TRAN MAX38 MAX V(out) FROM=380m TO=390m
.MEAS TRAN MIN39 MIN V(out) FROM=390m TO=400m
.MEAS TRAN MAX39 MAX V(out) FROM=390m TO=400m
.MEAS TRAN MIN40 MIN V(out) FROM=400m TO=410m
.MEAS TRAN MAX40 MAX V(out) FROM=400m TO=410m
.MEAS TRAN MIN41 MIN V(out) FROM=410m TO=420m
.MEAS TRAN MAX41 MAX V(out) FROM=410m TO=420m
.MEAS TRAN MIN42 MIN V(out) FROM=420m TO=430m
.MEAS TRAN MAX42 MAX V(out) FROM=420m TO=430m
.MEAS TRAN MIN43 MIN V(out) FROM=430m TO=440m
.MEAS TRAN MAX43 MAX V(out) FROM=430m TO=440m
.MEAS TRAN MIN44 MIN V(out) FROM=440m TO=450m
.MEAS TRAN MAX44 MAX V(out) FROM=440m TO=450m
.MEAS TRAN MIN45 MIN V(out) FROM=450m TO=460m
.MEAS TRAN MAX45 MAX V(out) FROM=450m TO=460m
.MEAS TRAN MIN46 MIN V(out) FROM=460m TO=470m
.MEAS TRAN MAX46 MAX V(out) FROM=460m TO=470m
.MEAS TRAN MIN47 MIN V(out) FROM=470m TO=480m
.MEAS TRAN MAX47 MAX V(out) FROM=470m TO=480m
.MEAS TRAN MIN48 MIN V(out) FROM=480m TO=490m
.MEAS TRAN MAX48 MAX V(out) FROM=480m TO=490m
.MEAS TRAN MIN49 MIN V(out) FROM=490m TO=500m
.MEAS TRAN MAX49 MAX V(out) FROM=490m TO=500m
.MEAS TRAN MIN50 MIN V(out) FROM=500m TO=510m
.MEAS TRAN MAX50 MAX V(out) FROM=500m TO=510m
.MEAS TRAN MIN51 MIN V(out) FROM=510m TO=520m
.MEAS TRAN MAX51 MAX V(out) FROM=510m TO=520m
.MEAS TRAN MIN52 MIN V(out) FROM=520m TO=530m
.MEAS TRAN MAX52 MAX V(out) FROM=520m TO=530m
.MEAS TRAN MIN53 MIN V(out) FROM=530m TO=540m
.MEAS TRAN MAX53 MAX V(out) FROM=530m TO=540m
.MEAS TRAN MIN54 MIN V(out) FROM=540m TO=550m
.MEAS TRAN MAX54 MAX V(out) FROM=540m TO=550m
.MEAS TRAN MIN55 MIN V(out) FROM=550m TO=560m
.MEAS TRAN MAX55 MAX V(out) FROM=550m TO=560m
.MEAS TRAN MIN56 MIN V(out) FROM=560m TO=570m
.MEAS TRAN MAX56 MAX V(out) FROM=560m TO=570m
.MEAS TRAN MIN57 MIN V(out) FROM=570m TO=580m
.MEAS TRAN MAX57 MAX V(out) FROM=570m TO=580m
.MEAS TRAN MIN58 MIN V(out) FROM=580m TO=590m
.MEAS TRAN MAX58 MAX V(out) FROM=580m TO=590m
.MEAS TRAN MIN59 MIN V(out) FROM=590m TO=600m
.MEAS TRAN MAX59 MAX V(out) FROM=590m TO=600m
.MEAS TRAN MIN60 MIN V(out) FROM=600m TO=610m
.MEAS TRAN MAX60 MAX V(out) FROM=600m TO=610m
.MEAS TRAN MIN61 MIN V(out) FROM=610m TO=620m
.MEAS TRAN MAX61 MAX V(out) FROM=610m TO=620m
.MEAS TRAN MIN62 MIN V(out) FROM=620m TO=630m
.MEAS TRAN MAX62 MAX V(out) FROM=620m TO=630m
.MEAS TRAN MIN63 MIN V(out) FROM=630m TO=640m
.MEAS TRAN MAX63 MAX V(out) FROM=630m TO=640m
.MEAS TRAN MIN64 MIN V(out) FROM=640m TO=650m
.MEAS TRAN MAX64 MAX V(out) FROM=640m TO=650m
.MEAS TRAN MIN65 MIN V(out) FROM=650m TO=660m
.MEAS TRAN MAX65 MAX V(out) FROM=650m TO=660m
.MEAS TRAN MIN66 MIN V(out) FROM=660m TO=670m
.MEAS TRAN MAX66 MAX V(out) FROM=660m TO=670m
.MEAS TRAN MIN67 MIN V(out) FROM=670m TO=680m
.MEAS TRAN MAX67 MAX V(out) FROM=670m TO=680m
.MEAS TRAN MIN68 MIN V(out) FROM=680m TO=690m
.MEAS TRAN MAX68 MAX V(out) FROM=680m TO=690m
.MEAS TRAN MIN69 MIN V(out) FROM=690m TO=700m
.MEAS TRAN MAX69 MAX V(out) FROM=690m TO=700m
.MEAS TRAN MIN70 MIN V(out) FROM=700m TO=710m
.MEAS TRAN MAX70 MAX V(out) FROM=700m TO=710m
.MEAS TRAN MIN71 MIN V(out) FROM=710m TO=720m
.MEAS TRAN MAX71 MAX V(out) FROM=710m TO=720m
.MEAS TRAN MIN72 MIN V(out) FROM=720m TO=730m
.MEAS TRAN MAX72 MAX V(out) FROM=720m TO=730m
.MEAS TRAN MIN73 MIN V(out) FROM=730m TO=740m
.MEAS TRAN MAX73 MAX V(out) FROM=730m TO=740m
.MEAS TRAN MIN74 MIN V(out) FROM=740m TO=750m
.MEAS TRAN MAX74 MAX V(out) FROM=740m TO=750m
.MEAS TRAN MIN75 MIN V(out) FROM=750m TO=760m
.MEAS TRAN MAX75 MAX V(out) FROM=750m TO=760m
.MEAS TRAN MIN76 MIN V(out) FROM=760m TO=770m
.MEAS TRAN MAX76 MAX V(out) FROM=760m TO=770m
.MEAS TRAN MIN77 MIN V(out) FROM=770m TO=780m
.MEAS TRAN MAX77 MAX V(out) FROM=770m TO=780m
.MEAS TRAN MIN78 MIN V(out) FROM=780m TO=790m
.MEAS TRAN MAX78 MAX V(out) FROM=780m TO=790m
.MEAS TRAN MIN79 MIN V(out) FROM=790m TO=800m
.MEAS TRAN MAX79 MAX V(out) FROM=790m TO=800m
.MEAS TRAN MIN80 MIN V(out) FROM=800m TO=810m
.MEAS TRAN MAX80 MAX V(out) FROM=800m TO=810m
.MEAS TRAN MIN81 MIN V(out) FROM=810m TO=820m
.MEAS TRAN MAX81 MAX V(out) FROM=810m TO=820m
.MEAS TRAN MIN82 MIN V(out) FROM=820m TO=830m
.MEAS TRAN MAX82 MAX V(out) FROM=820m TO=830m
.MEAS TRAN MIN83 MIN V(out) FROM=830m TO=840m
.MEAS TRAN MAX83 MAX V(out) FROM=830m TO=840m
.MEAS TRAN MIN84 MIN V(out) FROM=840m TO=850m
.MEAS TRAN MAX84 MAX V(out) FROM=840m TO=850m
.MEAS TRAN MIN85 MIN V(out) FROM=850m TO=860m
.MEAS TRAN MAX85 MAX V(out) FROM=850m TO=860m
.MEAS TRAN MIN86 MIN V(out) FROM=860m TO=870m
.MEAS TRAN MAX86 MAX V(out) FROM=860m TO=870m
.MEAS TRAN MIN87 MIN V(out) FROM=870m TO=880m
.MEAS TRAN MAX87 MAX V(out) FROM=870m TO=880m
.MEAS TRAN MIN88 MIN V(out) FROM=880m TO=890m
.MEAS TRAN MAX88 MAX V(out) FROM=880m TO=890m
.MEAS TRAN MIN89 MIN V(out) FROM=890m TO=900m
.MEAS TRAN MAX89 MAX V(out) FROM=890m TO=900m
.MEAS TRAN MIN90 MIN V(out) FROM=900m TO=910m
.MEAS TRAN MAX90 MAX V(out) FROM=900m TO=910m
.MEAS TRAN MIN91 MIN V(out) FROM=910m TO=920m
.MEAS TRAN MAX91 MAX V(out) FROM=910m TO=920m
.MEAS TRAN MIN92 MIN V(out) FROM=920m TO=930m
.MEAS TRAN MAX92 MAX V(out) FROM=920m TO=930m
.MEAS TRAN MIN93 MIN V(out) FROM=930m TO=940m
.MEAS TRAN MAX93 MAX V(out) FROM=930m TO=940m
.MEAS TRAN MIN94 MIN V(out) FROM=940m TO=950m
.MEAS TRAN MAX94 MAX V(out) FROM=940m TO=950m
.MEAS TRAN MIN95 MIN V(out) FROM=950m TO=960m
.MEAS TRAN MAX95 MAX V(out) FROM=950m TO=960m
.MEAS TRAN MIN96 MIN V(out) FROM=960m TO=970m
.MEAS TRAN MAX96 MAX V(out) FROM=960m TO=970m
.MEAS TRAN MIN97 MIN V(out) FROM=970m TO=980m
.MEAS TRAN MAX97 MAX V(out) FROM=970m TO=980m
.MEAS TRAN MIN98 MIN V(out) FROM=980m TO=990m
.MEAS TRAN MAX98 MAX V(out) FROM=980m TO=990m
.MEAS TRAN MIN99 MIN V(out) FROM=990m TO=1000m
.MEAS TRAN MAX99 MAX V(out) FROM=990m TO=1000m
.MEAS TRAN MIN100 MIN V(out) FROM=1000m TO=1010m
.MEAS TRAN MAX100 MAX V(out) FROM=1000m TO=1010m
.lib trafos.lib
.lib tubes.lib
.lib tube.lib
.backanno
.end